# EAGLE design beagle-cape (EAGLE 6.3)

## Sheet 1 of 3
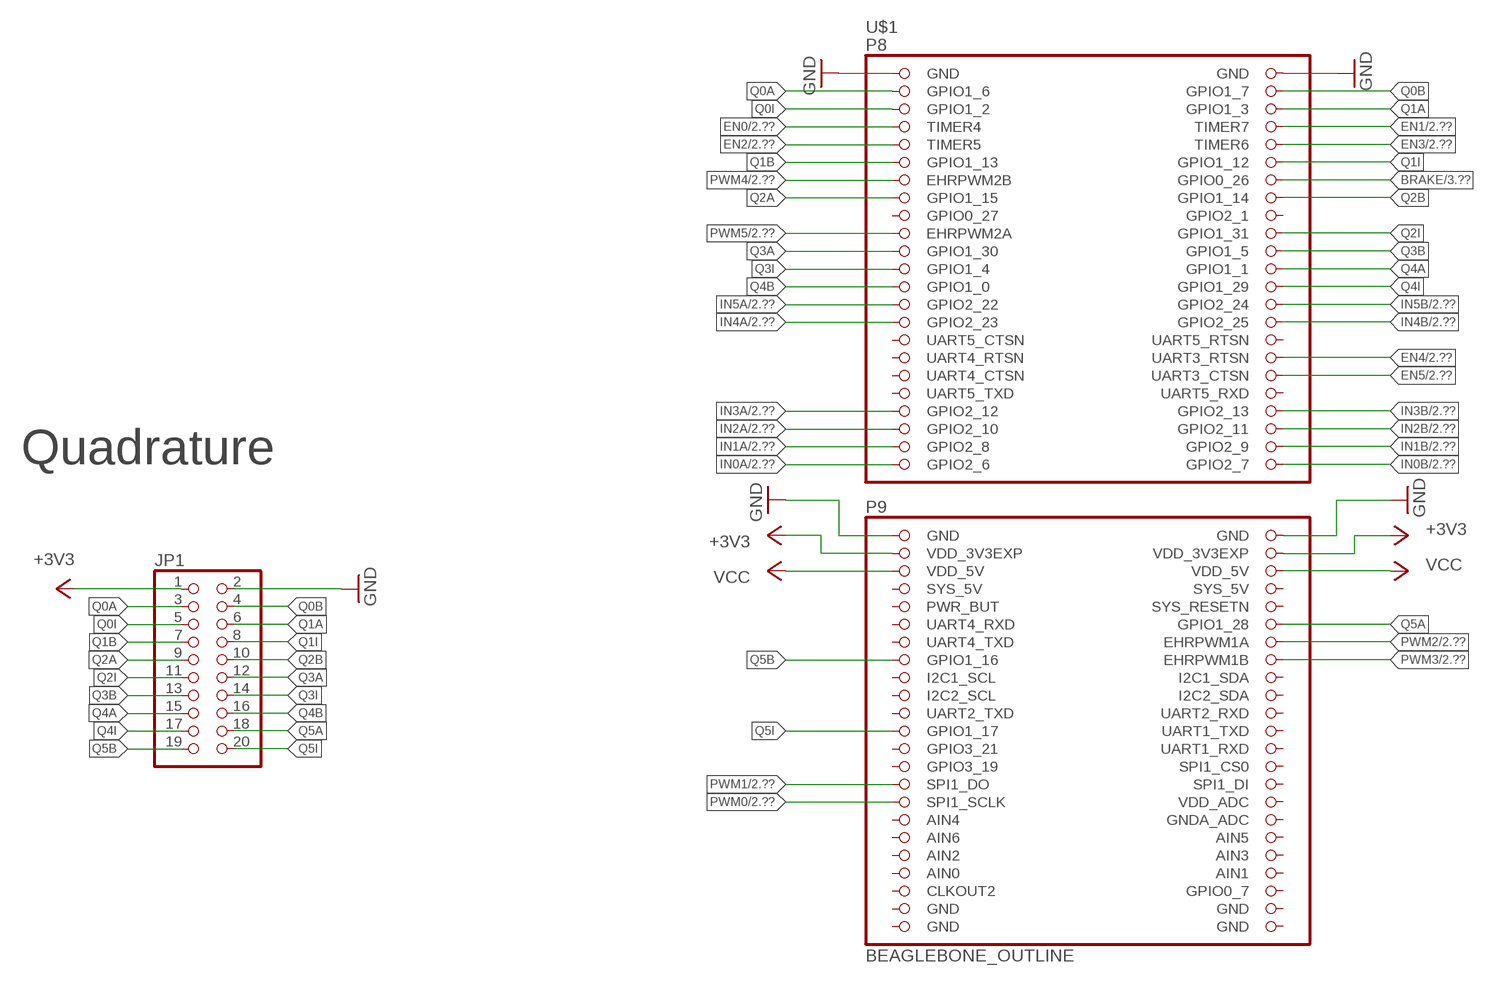
[diagram p0: schematic, sheet 1]

### Parts
JP1  PINHD-2X10  [2X10]
U$1  BEAGLEBONE_OUTLINE  [BEAGLEBONE_SHIELD]

### Nets
+3V3 [Motor]: JP1.1 U$1.49(VDD_3V3EXP) U$1.50(VDD_3V3EXP) ; also sheet 3
BRAKE: U$1.14(GPIO0_26) ; also sheet 3
EN0: U$1.7(TIMER4) ; also sheet 2
EN1: U$1.8(TIMER7) ; also sheet 2
EN2: U$1.9(TIMER5) ; also sheet 2
EN3: U$1.10(TIMER6) ; also sheet 2
EN4: U$1.34(UART3_RTSN) ; also sheet 2
EN5: U$1.36(UART3_CTSN) ; also sheet 2
GND: JP1.2 U$1.1(GND) U$1.2(GND) U$1.47(GND) U$1.48(GND) ; also sheet 2,3
IN0A: U$1.45(GPIO2_6) ; also sheet 2
IN0B: U$1.46(GPIO2_7) ; also sheet 2
IN1A: U$1.43(GPIO2_8) ; also sheet 2
IN1B: U$1.44(GPIO2_9) ; also sheet 2
IN2A: U$1.41(GPIO2_10) ; also sheet 2
IN2B: U$1.42(GPIO2_11) ; also sheet 2
IN3A: U$1.39(GPIO2_12) ; also sheet 2
IN3B: U$1.40(GPIO2_13) ; also sheet 2
IN4A: U$1.29(GPIO2_23) ; also sheet 2
IN4B: U$1.30(GPIO2_25) ; also sheet 2
IN5A: U$1.27(GPIO2_22) ; also sheet 2
IN5B: U$1.28(GPIO2_24) ; also sheet 2
PWM0: U$1.77(SPI1_SCLK) ; also sheet 2
PWM1: U$1.75(SPI1_DO) ; also sheet 2
PWM2: U$1.60(EHRPWM1A) ; also sheet 2
PWM3: U$1.62(EHRPWM1B) ; also sheet 2
PWM4: U$1.13(EHRPWM2B) ; also sheet 2
PWM5: U$1.19(EHRPWM2A) ; also sheet 2
Q0A: JP1.3 U$1.3(GPIO1_6)
Q0B: JP1.4 U$1.4(GPIO1_7)
Q0I: JP1.5 U$1.5(GPIO1_2)
Q1A: JP1.6 U$1.6(GPIO1_3)
Q1B: JP1.7 U$1.11(GPIO1_13)
Q1I: JP1.8 U$1.12(GPIO1_12)
Q2A: JP1.9 U$1.15(GPIO1_15)
Q2B: JP1.10 U$1.16(GPIO1_14)
Q2I: JP1.11 U$1.20(GPIO1_31)
Q3A: JP1.12 U$1.21(GPIO1_30)
Q3B: JP1.13 U$1.22(GPIO1_5)
Q3I: JP1.14 U$1.23(GPIO1_4)
Q4A: JP1.15 U$1.24(GPIO1_1)
Q4B: JP1.16 U$1.25(GPIO1_0)
Q4I: JP1.17 U$1.26(GPIO1_29)
Q5A: JP1.18 U$1.58(GPIO1_28)
Q5B: JP1.19 U$1.61(GPIO1_16)
Q5I: JP1.20 U$1.69(GPIO1_17)
VCC: U$1.51(VDD_5V) U$1.52(VDD_5V) ; also sheet 2,3
Unconnected: U$1.17(GPIO0_27) U$1.18(GPIO2_1) U$1.31(UART5_CTSN) U$1.32(UART5_RTSN) U$1.33(UART4_RTSN) U$1.35(UART4_CTSN) U$1.37(UART5_TXD) U$1.38(UART5_RXD) U$1.53(SYS_5V) U$1.54(SYS_5V) U$1.55(PWR_BUT) U$1.56(SYS_RESETN) U$1.57(UART4_RXD) U$1.59(UART4_TXD) U$1.63(I2C1_SCL) U$1.64(I2C1_SDA) U$1.65(I2C2_SCL) U$1.66(I2C2_SDA) U$1.67(UART2_TXD) U$1.68(UART2_RXD) U$1.70(UART1_TXD) U$1.71(GPIO3_21) U$1.72(UART1_RXD) U$1.73(GPIO3_19) U$1.74(SPI1_CS0) U$1.76(SPI1_DI) U$1.78(VDD_ADC) U$1.79(AIN4) U$1.80(GNDA_ADC) U$1.81(AIN6) U$1.82(AIN5) U$1.83(AIN2) U$1.84(AIN3) U$1.85(AIN0) U$1.86(AIN1) U$1.87(CLKOUT2) U$1.88(GPIO0_7)

### Notes on the sheet
- Quadrature

## Sheet 2 of 3
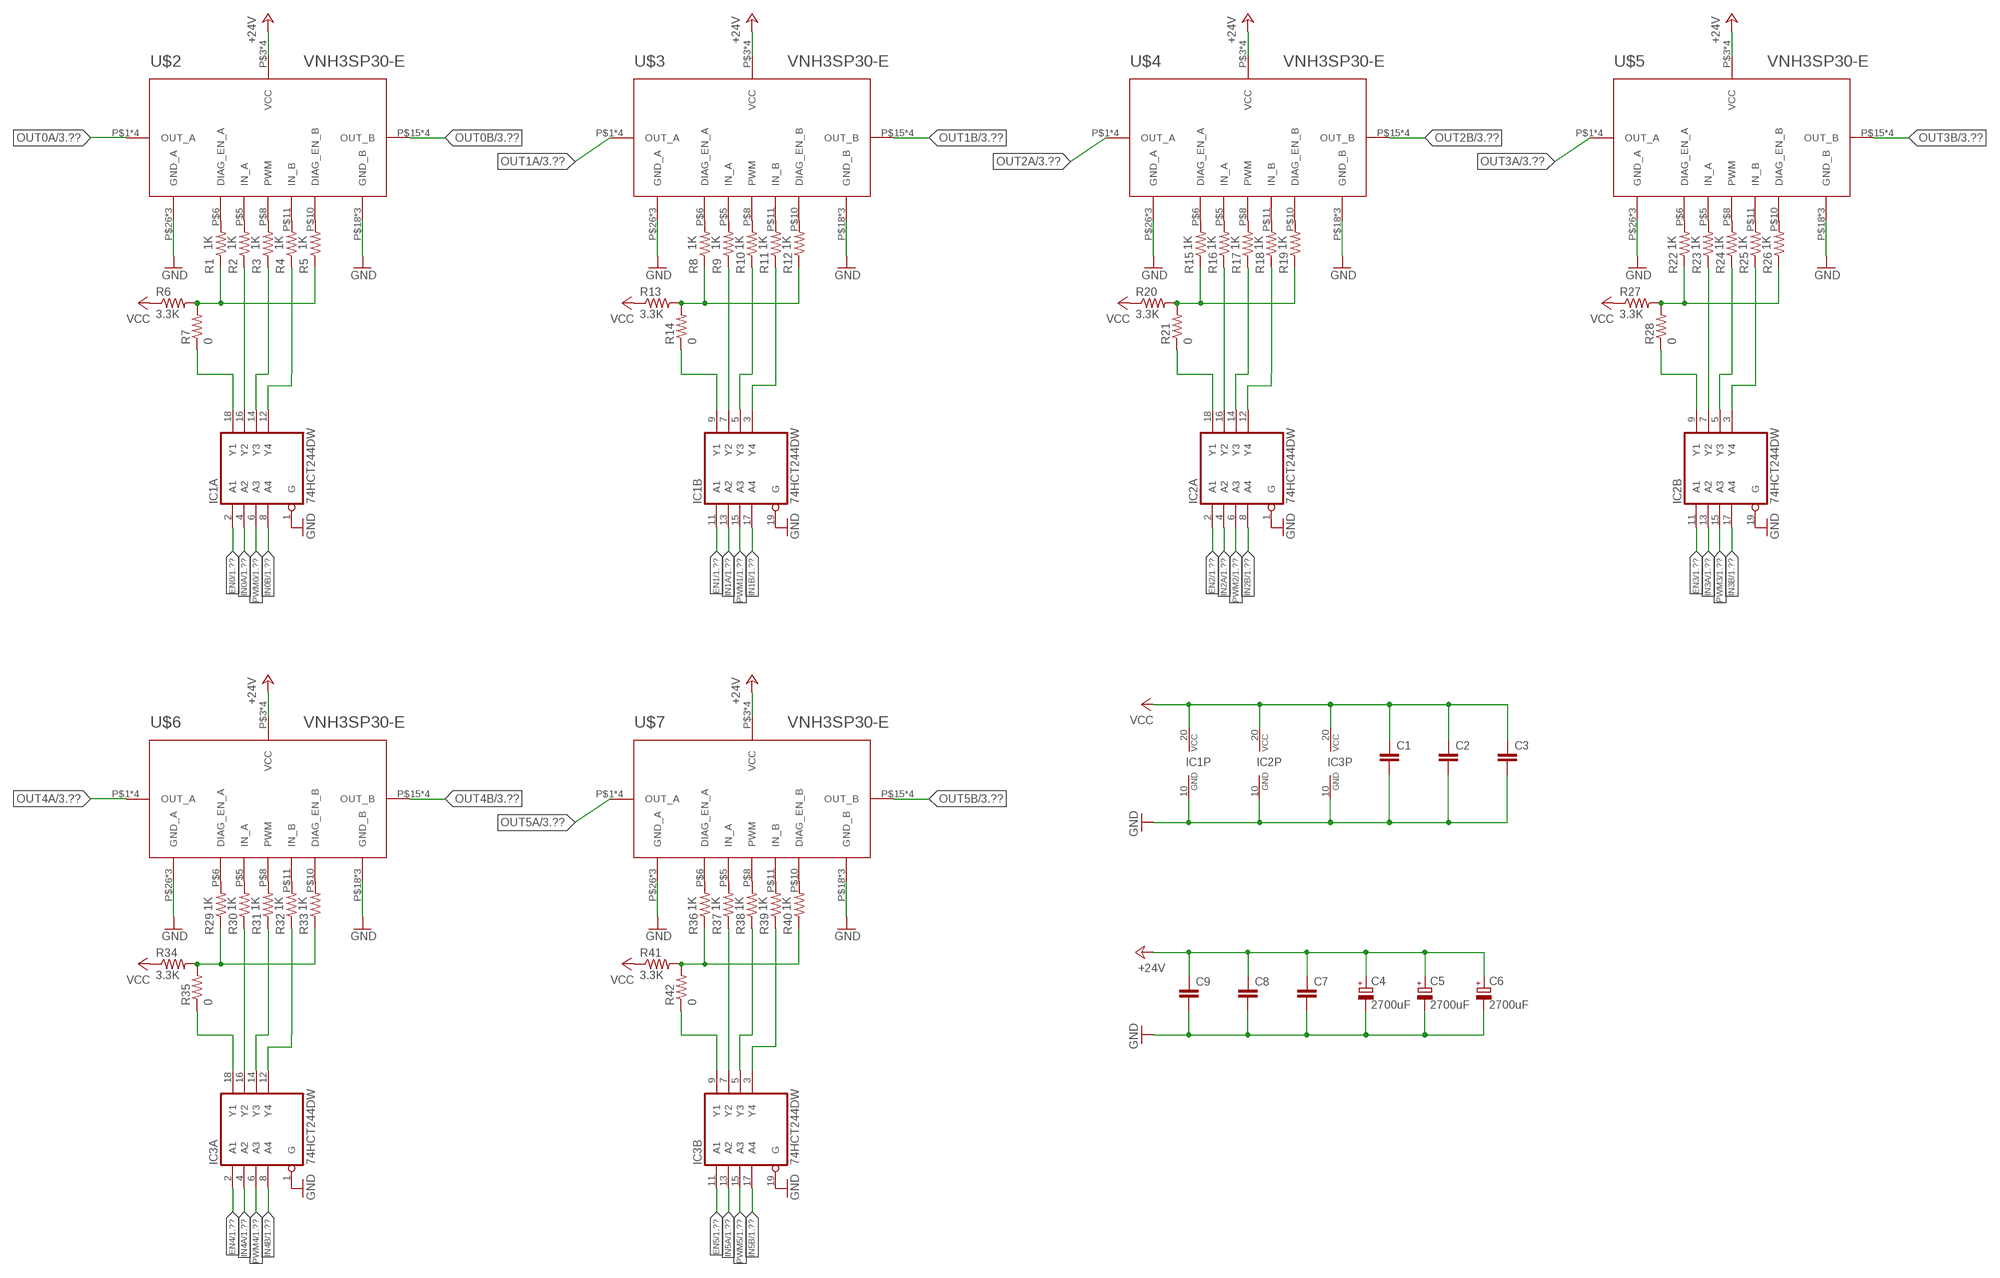
[diagram p1: schematic, sheet 2]

### Parts
C1  C-EUC1206  [C1206]
C2  C-EUC1206  [C1206]
C3  C-EUC1206  [C1206]
C4  2700uF  CPOL-EUE5-13  [E5-13]
C5  2700uF  CPOL-EUE5-13  [E5-13]
C6  2700uF  CPOL-EUE5-13  [E5-13]
C7  C-EUC1206  [C1206]
C8  C-EUC1206  [C1206]
C9  C-EUC1206  [C1206]
IC1  74HCT244DW  [SO20W]
IC2  74HCT244DW  [SO20W]
IC3  74HCT244DW  [SO20W]
R1  1K  R-US_R1206  [R1206]
R2  1K  R-US_R1206  [R1206]
R3  1K  R-US_R1206  [R1206]
R4  1K  R-US_R1206  [R1206]
R5  1K  R-US_R1206  [R1206]
R6  3.3K  R-US_R1206  [R1206]
R7  0  R-US_R1206  [R1206]
R8  1K  R-US_R1206  [R1206]
R9  1K  R-US_R1206  [R1206]
R10  1K  R-US_R1206  [R1206]
R11  1K  R-US_R1206  [R1206]
R12  1K  R-US_R1206  [R1206]
R13  3.3K  R-US_R1206  [R1206]
R14  0  R-US_R1206  [R1206]
R15  1K  R-US_R1206  [R1206]
R16  1K  R-US_R1206  [R1206]
R17  1K  R-US_R1206  [R1206]
R18  1K  R-US_R1206  [R1206]
R19  1K  R-US_R1206  [R1206]
R20  3.3K  R-US_R1206  [R1206]
R21  0  R-US_R1206  [R1206]
R22  1K  R-US_R1206  [R1206]
R23  1K  R-US_R1206  [R1206]
R24  1K  R-US_R1206  [R1206]
R25  1K  R-US_R1206  [R1206]
R26  1K  R-US_R1206  [R1206]
R27  3.3K  R-US_R1206  [R1206]
R28  0  R-US_R1206  [R1206]
R29  1K  R-US_R1206  [R1206]
R30  1K  R-US_R1206  [R1206]
R31  1K  R-US_R1206  [R1206]
R32  1K  R-US_R1206  [R1206]
R33  1K  R-US_R1206  [R1206]
R34  3.3K  R-US_R1206  [R1206]
R35  0  R-US_R1206  [R1206]
R36  1K  R-US_R1206  [R1206]
R37  1K  R-US_R1206  [R1206]
R38  1K  R-US_R1206  [R1206]
R39  1K  R-US_R1206  [R1206]
R40  1K  R-US_R1206  [R1206]
R41  3.3K  R-US_R1206  [R1206]
R42  0  R-US_R1206  [R1206]
U$2  VNH3SP30-E  [MULTIPOWER-SO-30]
U$3  VNH3SP30-E  [MULTIPOWER-SO-30]
U$4  VNH3SP30-E  [MULTIPOWER-SO-30]
U$5  VNH3SP30-E  [MULTIPOWER-SO-30]
U$6  VNH3SP30-E  [MULTIPOWER-SO-30]
U$7  VNH3SP30-E  [MULTIPOWER-SO-30]

### Nets
+24V: C4.+ C5.+ C6.+ C7.1 C8.1 C9.1 U$2.P$3(VCC) U$2.P$13(VCC) U$2.P$23(VCC) U$2.T$3(VCC) U$3.P$3(VCC) U$3.P$13(VCC) U$3.P$23(VCC) U$3.T$3(VCC) U$4.P$3(VCC) U$4.P$13(VCC) U$4.P$23(VCC) U$4.T$3(VCC) U$5.P$3(VCC) U$5.P$13(VCC) U$5.P$23(VCC) U$5.T$3(VCC) U$6.P$3(VCC) U$6.P$13(VCC) U$6.P$23(VCC) U$6.T$3(VCC) U$7.P$3(VCC) U$7.P$13(VCC) U$7.P$23(VCC) U$7.T$3(VCC) ; also sheet 3
EN0: IC1.2(A:A1) ; also sheet 1
EN1: IC1.11(B:A1) ; also sheet 1
EN2: IC2.2(A:A1) ; also sheet 1
EN3: IC2.11(B:A1) ; also sheet 1
EN4: IC3.2(A:A1) ; also sheet 1
EN5: IC3.11(B:A1) ; also sheet 1
GND: C1.2 C2.2 C3.2 C4.- C5.- C6.- C7.2 C8.2 C9.2 IC1.1(A:G) IC1.10(P:GND) IC1.19(B:G) IC2.1(A:G) IC2.10(P:GND) IC2.19(B:G) IC3.1(A:G) IC3.10(P:GND) IC3.19(B:G) U$2.P$18(GND_B) U$2.P$19(GND_B) U$2.P$20(GND_B) U$2.P$26(GND_A) U$2.P$27(GND_A) U$2.P$28(GND_A) U$3.P$18(GND_B) U$3.P$19(GND_B) U$3.P$20(GND_B) U$3.P$26(GND_A) U$3.P$27(GND_A) U$3.P$28(GND_A) U$4.P$18(GND_B) U$4.P$19(GND_B) U$4.P$20(GND_B) U$4.P$26(GND_A) U$4.P$27(GND_A) U$4.P$28(GND_A) U$5.P$18(GND_B) U$5.P$19(GND_B) U$5.P$20(GND_B) U$5.P$26(GND_A) U$5.P$27(GND_A) U$5.P$28(GND_A) U$6.P$18(GND_B) U$6.P$19(GND_B) U$6.P$20(GND_B) U$6.P$26(GND_A) U$6.P$27(GND_A) U$6.P$28(GND_A) U$7.P$18(GND_B) U$7.P$19(GND_B) U$7.P$20(GND_B) U$7.P$26(GND_A) U$7.P$27(GND_A) U$7.P$28(GND_A) ; also sheet 1,3
IN0A: IC1.4(A:A2) ; also sheet 1
IN0B: IC1.8(A:A4) ; also sheet 1
IN1A: IC1.13(B:A2) ; also sheet 1
IN1B: IC1.17(B:A4) ; also sheet 1
IN2A: IC2.4(A:A2) ; also sheet 1
IN2B: IC2.8(A:A4) ; also sheet 1
IN3A: IC2.13(B:A2) ; also sheet 1
IN3B: IC2.17(B:A4) ; also sheet 1
IN4A: IC3.4(A:A2) ; also sheet 1
IN4B: IC3.8(A:A4) ; also sheet 1
IN5A: IC3.13(B:A2) ; also sheet 1
IN5B: IC3.17(B:A4) ; also sheet 1
N$1: R1.2 U$2.P$6(DIAG_EN_A)
N$2: R1.1 R5.1 R6.2 R7.2
N$3: IC1.18(A:Y1) R7.1
N$4: IC1.16(A:Y2) R2.1
N$5: IC1.14(A:Y3) R3.1
N$6: IC1.12(A:Y4) R4.1
N$9: R2.2 U$2.P$5(IN_A)
N$10: R3.2 U$2.P$8(PWM)
N$11: R4.2 U$2.P$11(IN_B)
N$12: R5.2 U$2.P$10(DIAG_EN_B)
N$13: R8.2 U$3.P$6(DIAG_EN_A)
N$14: R8.1 R12.1 R13.2 R14.2
N$15: IC1.9(B:Y1) R14.1
N$16: IC1.7(B:Y2) R9.1
N$17: IC1.5(B:Y3) R10.1
N$18: IC1.3(B:Y4) R11.1
N$20: R39.2 U$7.P$11(IN_B)
N$21: R38.2 U$7.P$8(PWM)
N$22: R37.2 U$7.P$5(IN_A)
N$23: R40.2 U$7.P$10(DIAG_EN_B)
N$24: R15.2 U$4.P$6(DIAG_EN_A)
N$25: R15.1 R19.1 R20.2 R21.2
N$26: IC2.18(A:Y1) R21.1
N$27: IC2.16(A:Y2) R16.1
N$28: IC2.14(A:Y3) R17.1
N$29: IC2.12(A:Y4) R18.1
N$30: R12.2 U$3.P$10(DIAG_EN_B)
N$31: R11.2 U$3.P$11(IN_B)
N$32: R16.2 U$4.P$5(IN_A)
N$33: R17.2 U$4.P$8(PWM)
N$34: R18.2 U$4.P$11(IN_B)
N$35: R19.2 U$4.P$10(DIAG_EN_B)
N$36: R22.2 U$5.P$6(DIAG_EN_A)
N$37: R22.1 R26.1 R27.2 R28.2
N$38: IC2.9(B:Y1) R28.1
N$39: IC2.7(B:Y2) R23.1
N$40: IC2.5(B:Y3) R24.1
N$41: IC2.3(B:Y4) R25.1
N$42: R10.2 U$3.P$8(PWM)
N$43: R9.2 U$3.P$5(IN_A)
N$44: R29.2 U$6.P$6(DIAG_EN_A)
N$45: R29.1 R33.1 R34.2 R35.2
N$46: IC3.18(A:Y1) R35.1
N$47: IC3.16(A:Y2) R30.1
N$48: IC3.14(A:Y3) R31.1
N$49: IC3.12(A:Y4) R32.1
N$50: R26.2 U$5.P$10(DIAG_EN_B)
N$51: R25.2 U$5.P$11(IN_B)
N$52: R30.2 U$6.P$5(IN_A)
N$53: R31.2 U$6.P$8(PWM)
N$54: R32.2 U$6.P$11(IN_B)
N$55: R33.2 U$6.P$10(DIAG_EN_B)
N$56: R36.2 U$7.P$6(DIAG_EN_A)
N$57: R36.1 R40.1 R41.2 R42.2
N$58: IC3.9(B:Y1) R42.1
N$59: IC3.7(B:Y2) R37.1
N$60: IC3.5(B:Y3) R38.1
N$61: IC3.3(B:Y4) R39.1
N$62: R24.2 U$5.P$8(PWM)
N$63: R23.2 U$5.P$5(IN_A)
OUT0A [Motor]: U$2.P$1(OUT_A) U$2.P$25(OUT_A) U$2.P$30(OUT_A) U$2.T$1(OUT_A) ; also sheet 3
OUT0B [Motor]: U$2.P$15(OUT_B) U$2.P$16(OUT_B) U$2.P$21(OUT_B) U$2.T$2(OUT_B) ; also sheet 3
OUT1A [Motor]: U$3.P$1(OUT_A) U$3.P$25(OUT_A) U$3.P$30(OUT_A) U$3.T$1(OUT_A) ; also sheet 3
OUT1B [Motor]: U$3.P$15(OUT_B) U$3.P$16(OUT_B) U$3.P$21(OUT_B) U$3.T$2(OUT_B) ; also sheet 3
OUT2A [Motor]: U$4.P$1(OUT_A) U$4.P$25(OUT_A) U$4.P$30(OUT_A) U$4.T$1(OUT_A) ; also sheet 3
OUT2B [Motor]: U$4.P$15(OUT_B) U$4.P$16(OUT_B) U$4.P$21(OUT_B) U$4.T$2(OUT_B) ; also sheet 3
OUT3A [Motor]: U$5.P$1(OUT_A) U$5.P$25(OUT_A) U$5.P$30(OUT_A) U$5.T$1(OUT_A) ; also sheet 3
OUT3B [Motor]: U$5.P$15(OUT_B) U$5.P$16(OUT_B) U$5.P$21(OUT_B) U$5.T$2(OUT_B) ; also sheet 3
OUT4A [Motor]: U$6.P$1(OUT_A) U$6.P$25(OUT_A) U$6.P$30(OUT_A) U$6.T$1(OUT_A) ; also sheet 3
OUT4B [Motor]: U$6.P$15(OUT_B) U$6.P$16(OUT_B) U$6.P$21(OUT_B) U$6.T$2(OUT_B) ; also sheet 3
OUT5A [Motor]: U$7.P$1(OUT_A) U$7.P$25(OUT_A) U$7.P$30(OUT_A) U$7.T$1(OUT_A) ; also sheet 3
OUT5B [Motor]: U$7.P$15(OUT_B) U$7.P$16(OUT_B) U$7.P$21(OUT_B) U$7.T$2(OUT_B) ; also sheet 3
PWM0: IC1.6(A:A3) ; also sheet 1
PWM1: IC1.15(B:A3) ; also sheet 1
PWM2: IC2.6(A:A3) ; also sheet 1
PWM3: IC2.15(B:A3) ; also sheet 1
PWM4: IC3.6(A:A3) ; also sheet 1
PWM5: IC3.15(B:A3) ; also sheet 1
VCC: C1.1 C2.1 C3.1 IC1.20(P:VCC) IC2.20(P:VCC) IC3.20(P:VCC) R6.1 R13.1 R20.1 R27.1 R34.1 R41.1 ; also sheet 1,3

## Sheet 3 of 3
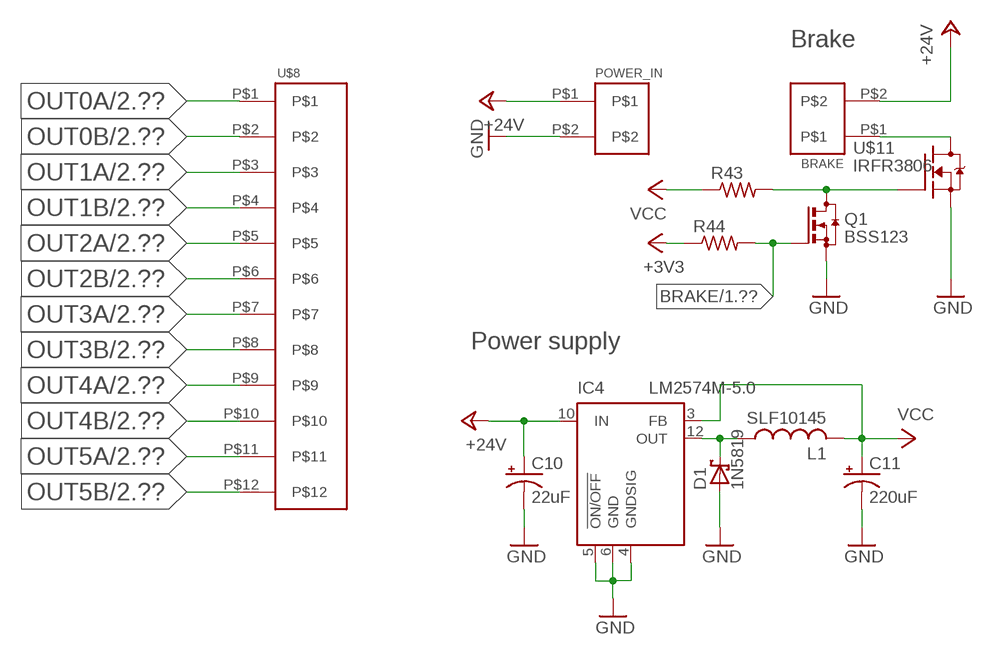
[diagram p2: schematic, sheet 3]

### Parts
BRAKE  PINHEAD-5MM-1X2  [5MM-HEADER-2]
C10  22uF  CPOL-USSANYO_SMD_E7  [SANYO-OSCON_SMD_E7]
C11  220uF  CPOL-USSANYO_SMD_F8  [SANYO-OSCON_SMD_F8]
D1  1N5819  [SOD-123]
IC4  LM2574M-5.0  [SO14W]
L1  SLF10145  [SMD10145]
POWER_IN  PINHEAD-5MM-1X2  [5MM-HEADER-2]
Q1  BSS123  [SOT23]
R43  R-US_R1206  [R1206]
R44  R-US_R1206  [R1206]
U$8  PINHEAD-0.2IN-1X12  [0.2IN-TERMINAL-BLOCK-12]
U$11  IRFR3806  [TO252]

### Nets
+3V3 [Motor]: R44.1 ; also sheet 1
+24V: BRAKE.P$2 C10.+ IC4.10(IN) POWER_IN.P$1 ; also sheet 2
BRAKE: Q1.1(G) R44.2 ; also sheet 1
GND: C10.- C11.- D1.A IC4.4(GNDSIG) IC4.5(!ON/OFF) IC4.6(GND) POWER_IN.P$2 Q1.2(S) U$11.2(S) ; also sheet 1,2
N$7: D1.C IC4.12(OUT) L1.P$1
N$8 [Motor]: BRAKE.P$1 U$11.3(D)
N$19: Q1.3(D) R43.2 U$11.1(G)
OUT0A [Motor]: U$8.P$1 ; also sheet 2
OUT0B [Motor]: U$8.P$2 ; also sheet 2
OUT1A [Motor]: U$8.P$3 ; also sheet 2
OUT1B [Motor]: U$8.P$4 ; also sheet 2
OUT2A [Motor]: U$8.P$5 ; also sheet 2
OUT2B [Motor]: U$8.P$6 ; also sheet 2
OUT3A [Motor]: U$8.P$7 ; also sheet 2
OUT3B [Motor]: U$8.P$8 ; also sheet 2
OUT4A [Motor]: U$8.P$9 ; also sheet 2
OUT4B [Motor]: U$8.P$10 ; also sheet 2
OUT5A [Motor]: U$8.P$11 ; also sheet 2
OUT5B [Motor]: U$8.P$12 ; also sheet 2
VCC: C11.+ IC4.3(FB) L1.P$2 R43.1 ; also sheet 1,2

### Notes on the sheet
- Brake
- Power supply

## Power pins joined to a net without a drawn wire
GND: U$1.89(GND) U$1.90(GND) U$1.91(GND) U$1.92(GND)

## Library data of the parts
BRAKE POWER_IN = controller:PINHEAD-5MM-1X2
C1-C3 C7-C9 = rcl:C-EU: CAPACITOR, European symbol
C4-C6 = rcl:CPOL-EU: POLARIZED CAPACITOR, European symbol
C10 C11 = rcl:CPOL-US: POLARIZED CAPACITOR, American symbol
D1 = typewriter-project:1N5819
IC1-IC3 = 74xx-eu:74*244: Octal BUFFER and LINE DRIVER, 3-state
IC4 = linear:LM2574?-*: SIMPLE SWITCHER 0.5A Step-Down Voltage Regulator Source: http://cache.national.com/ds/LM/LM2574.pdf
JP1 = pinhead:PINHD-2X10: PIN HEADER
L1 = typewriter-project:SLF10145
Q1 = transistor-small-signal:BSS123: N-CHANNEL MOS FET
R1-R42 = resistor:R-US_: RESISTOR, American symbol
R43 R44 = rcl:R-US_: RESISTOR, American symbol
U$1 = controller:BEAGLEBONE_OUTLINE: Should match A3 pinout - but not completely tested
U$2-U$7 = controller:VNH3SP30
U$8 = controller:PINHEAD-0.2IN-1X12
U$11 = controller:IRF?3806

## Net classes
1 Motor: width 0.5 mm, clearance 0.3 mm

## Board
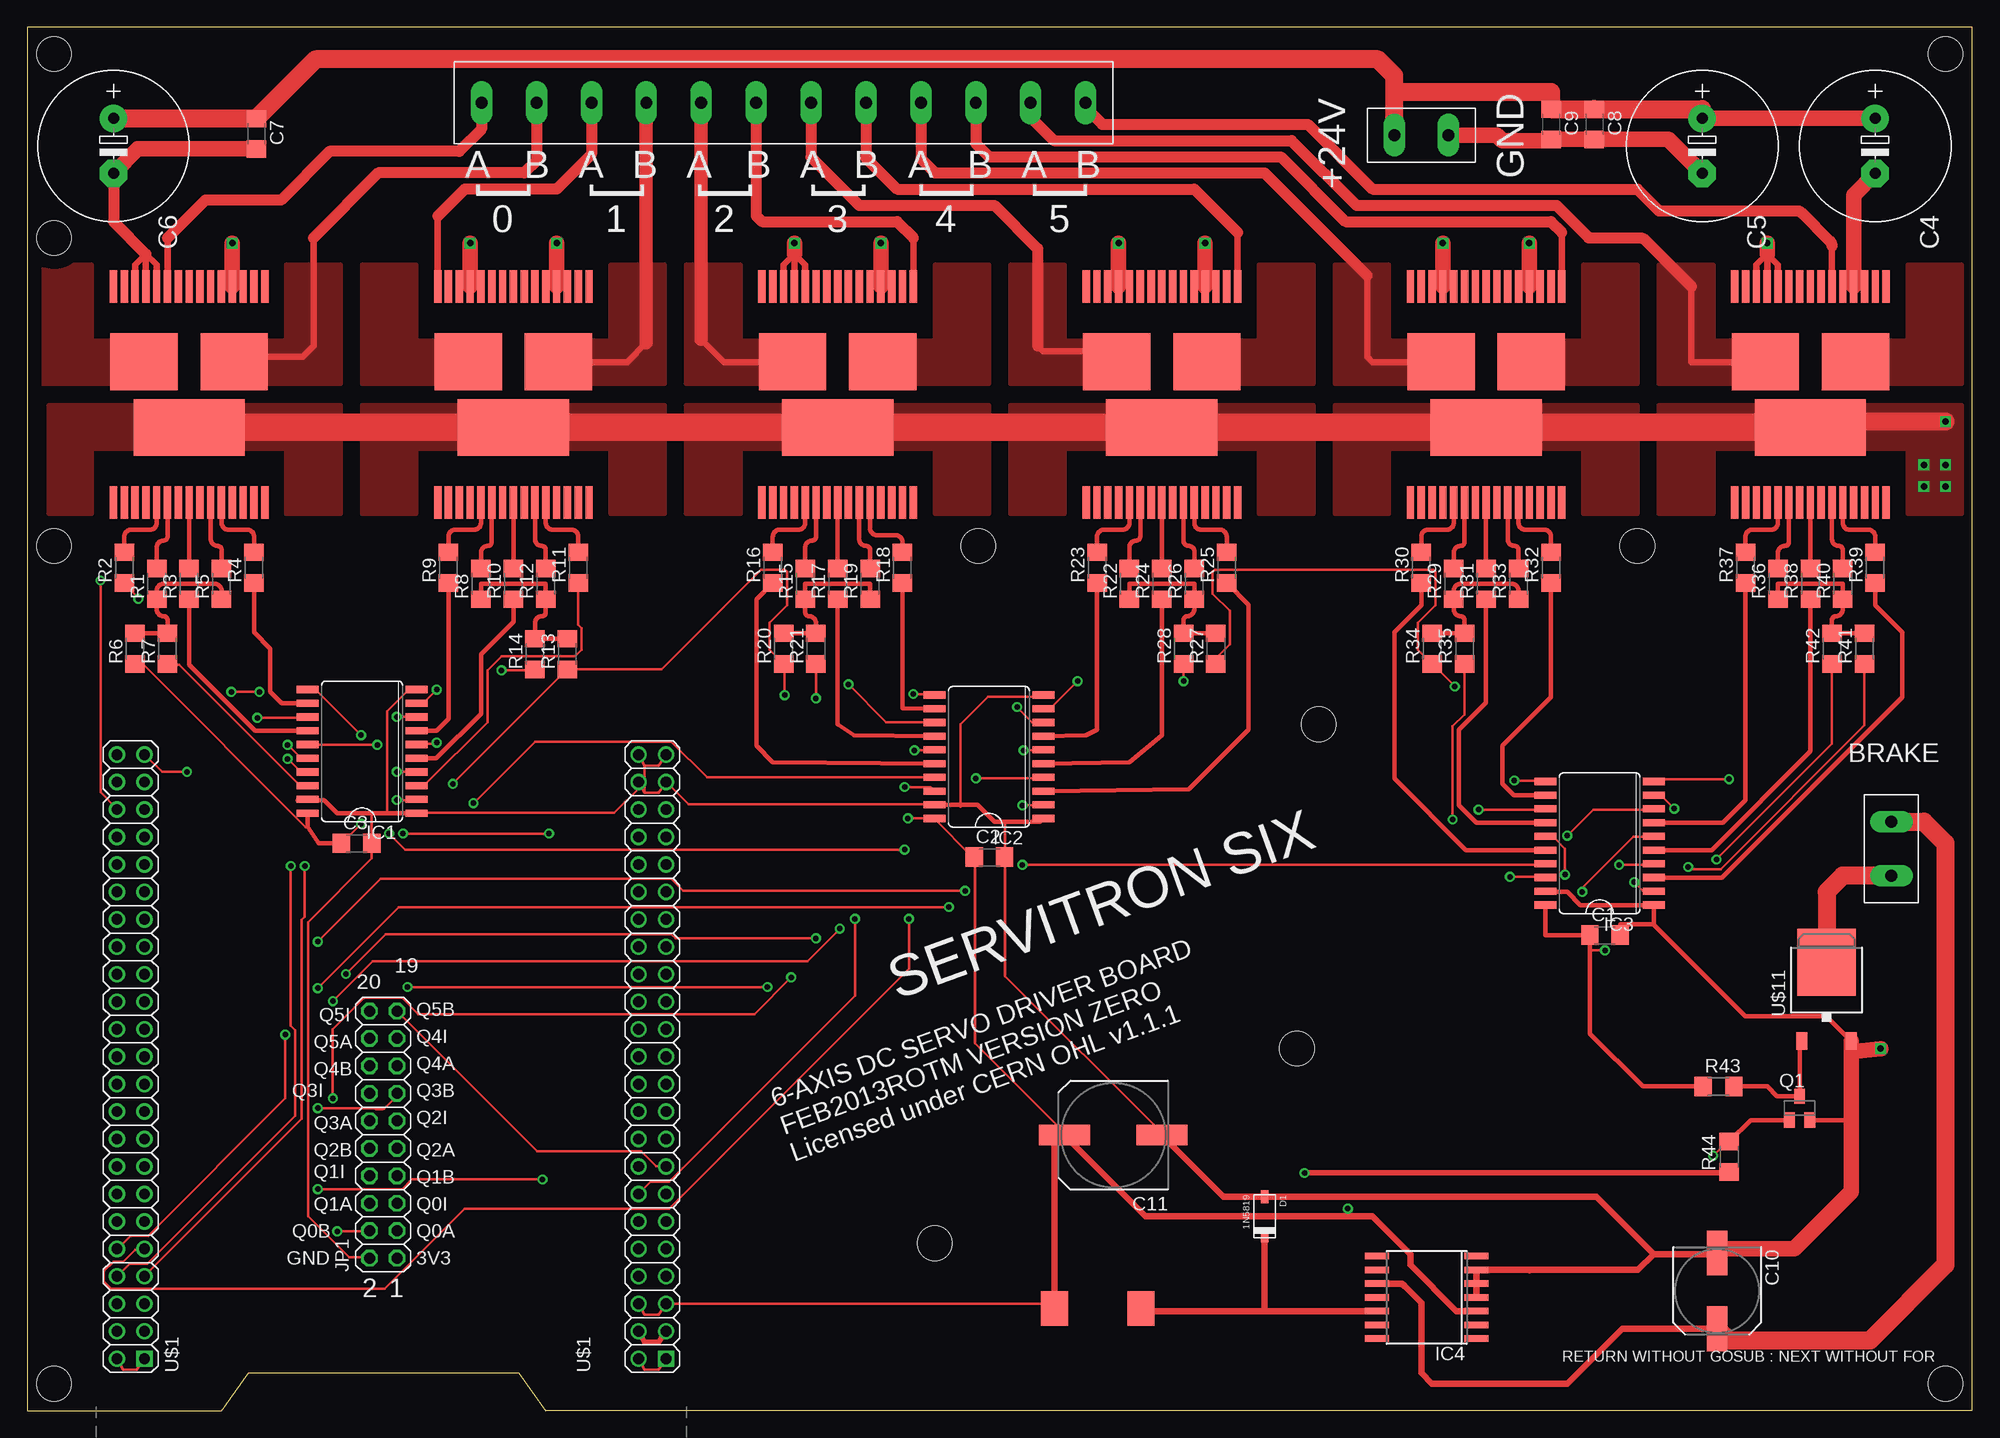
[diagram p3: board, top side]
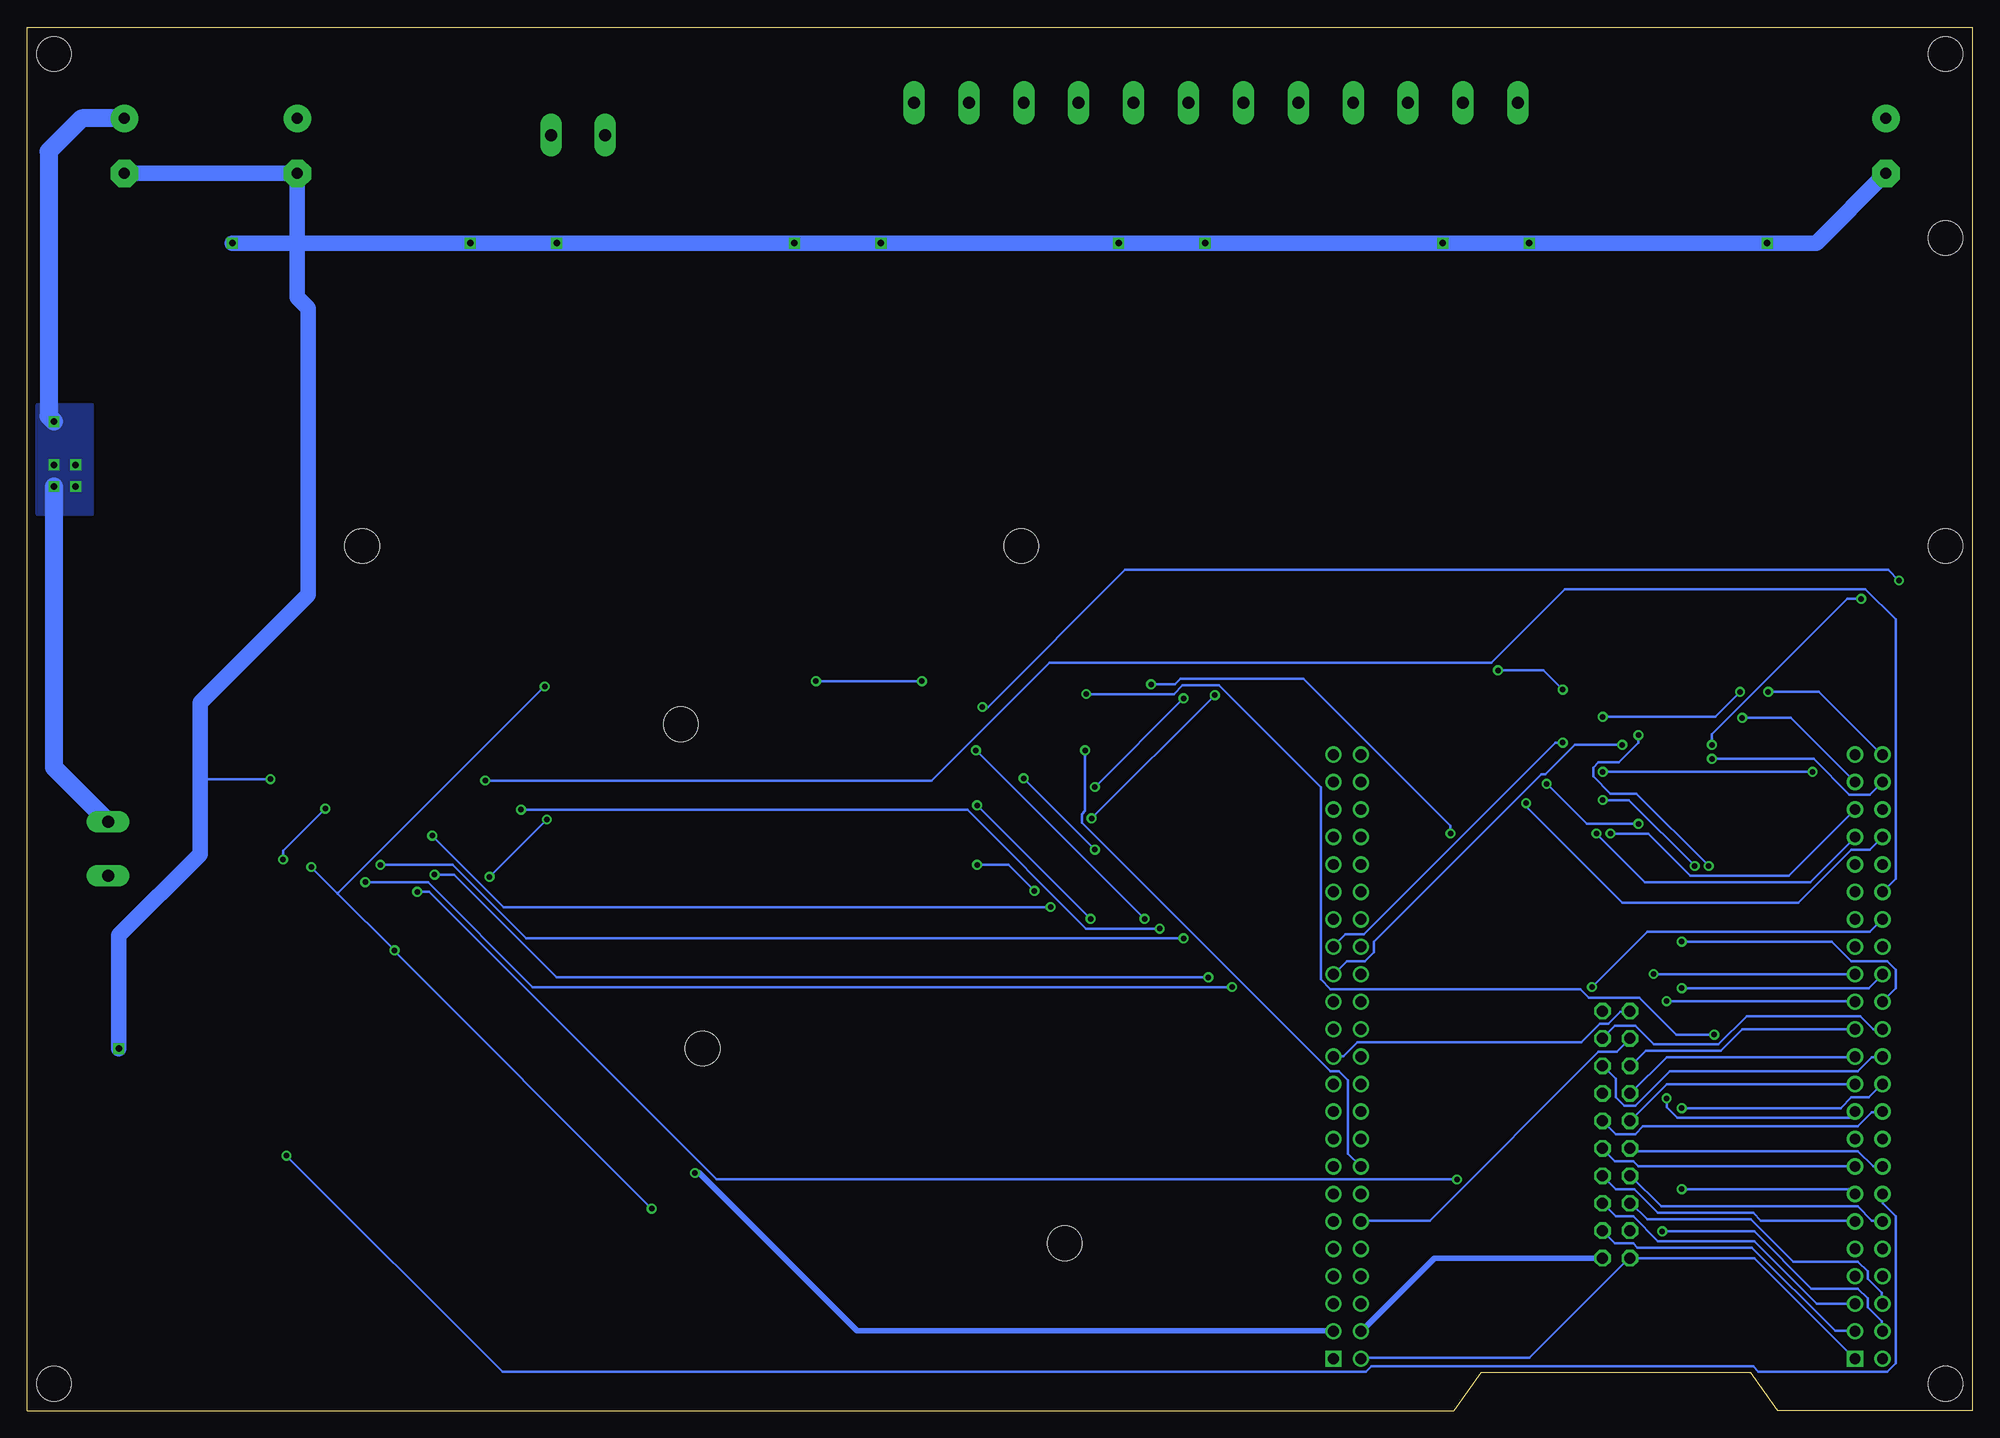
[diagram p4: board, bottom side, seen from below]

Size 180 x 128 mm. Coordinates in mm from the lower left corner, seen from the top.
Outline: 180,0 180,128 0,128 0,0 18,0 20.5,3.5 45.5,3.5 48,0 180,0
Copper layers (1*16): Top 0.035559375mm / dielectric 1.501140625mm / Bottom 0.035559375mm
Design rules "typical_4pcb": minimum track width 10mil, minimum drill 15mil, track to track 6mil, track to pad 6mil, pad to pad 6mil, via to via 6mil, smd to smd 6mil, copper to edge 15mil, drill to drill 8mil, minimum pad ring 10mil, minimum via ring 8mil, stop-mask expansion 4mil, vias tented up to drill 0mil, thermal gap 10mil
Holes 3.2 mm at 2.5,125.5 177.5,125.5 177.5,2.5 2.5,2.5 2.5,108.5 2.5,80 149,80 88,80 84,15.5 117.5,33.5 119.5,63.5

### Footprints (pad centres in the part's own frame; a part is rotated, then mirrored left to right if it is on the bottom)
5MM-HEADER-2 = drill 1.1 pad 2 long: P$1 -2.5,0; P$2 2.5,0
C1206 = smd 1.6 x 1.8: 1 -1.4,0; 2 1.4,0
E5-13 = drill 1.016 pad 2.54: + -2.54,0 | drill 1.016 pad 2.54 octagon: - 2.54,0
SANYO-OSCON_SMD_E7 = smd 4.15 x 1.9: + 3.5,0; - -3.5,0
SANYO-OSCON_SMD_F8 = smd 4.7 x 1.9: + 4.5,0; - -4.5,0
SOD-123 = smd 1.2 x 0.7: A -1.8,0; C 1.8,0
SO20W = smd 0.66 x 2.032: 1 -5.715,-5.029; 2 -4.445,-5.029; 3 -3.175,-5.029; 4 -1.905,-5.029; 5 -0.635,-5.029; 6 0.635,-5.029; 7 1.905,-5.029; 8 3.175,-5.029; 9 4.445,-5.029; 10 5.715,-5.029; 11 5.715,5.029; 12 4.445,5.029; 13 3.175,5.029; 14 1.905,5.029; 15 0.635,5.029; 16 -0.635,5.029; 17 -1.905,5.029; 18 -3.175,5.029; 19 -4.445,5.029; 20 -5.715,5.029
SO14W = smd 0.6 x 2.2: 1 -3.81,-4.6; 2 -2.54,-4.6; 3 -1.27,-4.6; 4 0,-4.6; 5 1.27,-4.6; 6 2.54,-4.6; 7 3.81,-4.6; 8 3.81,4.6; 9 2.54,4.6; 10 1.27,4.6; 11 0,4.6; 12 -1.27,4.6; 13 -2.54,4.6; 14 -3.81,4.6
2X10 = drill 1.016 octagon: 1 -11.43,-1.27; 2 -11.43,1.27; 3 -8.89,-1.27; 4 -8.89,1.27; 5 -6.35,-1.27; 6 -6.35,1.27; 7 -3.81,-1.27; 8 -3.81,1.27; 9 -1.27,-1.27; 10 -1.27,1.27; 11 1.27,-1.27; 12 1.27,1.27; 13 3.81,-1.27; 14 3.81,1.27; 15 6.35,-1.27; 16 6.35,1.27; 17 8.89,-1.27; 18 8.89,1.27; 19 11.43,-1.27; 20 11.43,1.27
SMD10145 = smd 3.2 x 2.5: P$1 0,4; P$2 0,-4
SOT23 = smd 1 x 1.4: 1 -0.95,-1.1; 2 0.95,-1.1; 3 0,1.1
R1206 = smd 1.6 x 1.803: 1 -1.422,0; 2 1.422,0
BEAGLEBONE_SHIELD = drill 1 square: 1 4.445,19.05; 47 52.705,19.05 | drill 1: 2 1.905,19.05; 3 4.445,21.59; 4 1.905,21.59; 5 4.445,24.13; 6 1.905,24.13; 7 4.445,26.67; 8 1.905,26.67; 9 4.445,29.21; 10 1.905,29.21; 11 4.445,31.75; 12 1.905,31.75; 13 4.445,34.29; 14 1.905,34.29; 15 4.445,36.83; 16 1.905,36.83; 17 4.445,39.37; 18 1.905,39.37; 19 4.445,41.91; 20 1.905,41.91; 21 4.445,44.45; 22 1.905,44.45; 23 4.445,46.99; 24 1.905,46.99; 25 4.445,49.53; 26 1.905,49.53; 27 4.445,52.07; 28 1.905,52.07; 29 4.445,54.61; 30 1.905,54.61; 31 4.445,57.15; 32 1.905,57.15; 33 4.445,59.69; 34 1.905,59.69; 35 4.445,62.23; 36 1.905,62.23; 37 4.445,64.77; 38 1.905,64.77; 39 4.445,67.31; 40 1.905,67.31; 41 4.445,69.85; 42 1.905,69.85; 43 4.445,72.39; 44 1.905,72.39; 45 4.445,74.93; 46 1.905,74.93; 48 50.165,19.05; 49 52.705,21.59; 50 50.165,21.59; 51 52.705,24.13; 52 50.165,24.13; 53 52.705,26.67; 54 50.165,26.67; 55 52.705,29.21; 56 50.165,29.21; 57 52.705,31.75; 58 50.165,31.75; 59 52.705,34.29; 60 50.165,34.29; 61 52.705,36.83; 62 50.165,36.83; 63 52.705,39.37; 64 50.165,39.37; 65 52.705,41.91; 66 50.165,41.91; 67 52.705,44.45; 68 50.165,44.45; 69 52.705,46.99; 70 50.165,46.99; 71 52.705,49.53; 72 50.165,49.53; 73 52.705,52.07; 74 50.165,52.07; 75 52.705,54.61; 76 50.165,54.61; 77 52.705,57.15; 78 50.165,57.15; 79 52.705,59.69; 80 50.165,59.69; 81 52.705,62.23; 82 50.165,62.23; 83 52.705,64.77; 84 50.165,64.77; 85 52.705,67.31; 86 50.165,67.31; 87 52.705,69.85; 88 50.165,69.85; 89 52.705,72.39; 90 50.165,72.39; 91 52.705,74.93; 92 50.165,74.93
MULTIPOWER-SO-30 = smd 0.68 x 3: P$1 -7,-10; P$2 -6,-10; P$3 -5,-10; P$4 -4,-10; P$5 -3,-10; P$6 -2,-10; P$7 -1,-10; P$8 0,-10; P$9 1,-10; P$10 2,-10; P$11 3,-10; P$12 4,-10; P$13 5,-10; P$14 6,-10; P$15 7,-10; P$16 7,10; P$17 6,10; P$18 5,10; P$19 4,10; P$20 3,10; P$21 2,10; P$22 1,10; P$23 0,10; P$24 -1,10; P$25 -2,10; P$26 -3,10; P$27 -4,10; P$28 -5,10; P$29 -6,10; P$30 -7,10 | smd 6.23 x 5.25: T$1 -4.165,3.05; T$2 4.165,3.05 | smd 10.3 x 5.25: T$3 0,-3.05
0.2IN-TERMINAL-BLOCK-12 = drill 1.1 pad 2 long: P$1 -27.94,0; P$2 -22.86,0; P$3 -17.78,0; P$4 -12.7,0; P$5 -7.62,0; P$6 -2.54,0; P$7 2.54,0; P$8 7.62,0; P$9 12.7,0; P$10 17.78,0; P$11 22.86,0; P$12 27.94,0
TO252 = smd 1 x 1.6: 1 -2.28,-4.8; 2 2.28,-4.8 | smd 5.4 x 6.2: 3 0,2.5

### Placement (x,y rotation side)
BRAKE  172.5,52 90 top
C1  146,44 0 top
C2  89.04,51.21 0 top
C3  30.5,52.5 0 top
C4  171,117 270 top
C5  155,117 270 top
C6  8,117 270 top
C7  21.21,118.12 270 top
C8  145,119 270 top
C9  141,119 270 top
C10  156.38,11.1 270 top
C11  100.5,25.5 180 top
D1  114.5,18 270 top
IC1  31,61 90 top
IC2  89,60.5 90 top
IC3  145.5,52.5 90 top
IC4  129.5,10.5 90 top
JP1  32.96,25.55 90 top
L1  99.08,9.48 270 top
POWER_IN  129,118 0 top
Q1  164,28 0 top
R1  12,76.5 90 top
R2  9,78 90 top
R3  15,76.5 90 top
R4  21,78 90 top
R5  18,76.5 90 top
R6  10,70.5 90 top
R7  13,70.5 90 top
R8  42,76.5 90 top
R9  39,78 90 top
R10  45,76.5 90 top
R11  51,78 90 top
R12  48,76.5 90 top
R13  50,70 90 top
R14  47,70 90 top
R15  72,76.5 90 top
R16  69,78 90 top
R17  75,76.5 90 top
R18  81,78 90 top
R19  78,76.5 90 top
R20  70,70.5 90 top
R21  73,70.5 90 top
R22  102,76.5 90 top
R23  99,78 90 top
R24  105,76.5 90 top
R25  111,78 90 top
R26  108,76.5 90 top
R27  110,70.5 90 top
R28  107,70.5 90 top
R29  132,76.5 90 top
R30  129,78 90 top
R31  135,76.5 90 top
R32  141,78 90 top
R33  138,76.5 90 top
R34  130,70.5 90 top
R35  133,70.5 90 top
R36  162,76.5 90 top
R37  159,78 90 top
R38  165,76.5 90 top
R39  171,78 90 top
R40  168,76.5 90 top
R41  170,70.5 90 top
R42  167,70.5 90 top
R43  156.5,30 0 top
R44  157.5,23.5 90 top
U$1  6.42,-14.23 0 top
U$2  15,94 0 top
U$3  45,94 0 top
U$4  75,94 0 top
U$5  105,94 0 top
U$6  135,94 0 top
U$7  165,94 0 top
U$8  70,121 0 top
U$11  166.5,39 0 top

### Tracks (layer width: path | path; a pad name or v marks a point on that pad's centre or on a via)
+3V3  (via drill 0.51)
  Top 0.5: U$1.50 57.15,6.35 58.42,6.35 U$1.49 | v118.2,22 157.5,22 R44.1
  Bottom 0.5: v118.2,22 117.8,22 103.2,7.4 59.2,7.4 U$1.49 | JP1.1 34.3,14.1 49.8,14.1 56.5,7.4 U$1.50
+24V  (via drill 0.6)
  Top 0.61: C10.+ 147.6,7.6 142.5,2.5 130,2.5 129,3.5 129,10 127.5,11.5 127.23,11.77 IC4.10
  Top 1.422: C5.+ C4.+
  Top 1.676: C5.+ 155,120.4 C8.1 C9.1 141,122 126.5,122 POWER_IN.P$1 126.5,123.5 125,125 26.69,125 C7.1 8.02,119.52 C6.+ | v177.5,91.5 165.55,91.5 U$7.T$3 | BRAKE.P$2 175.5,54.5 177.5,52.5 177.5,13.5 170.5,6.5 157.48,6.5 C10.+
  Top 2.54: 15,91 45,91 | 45,91 U$3.T$3 | 45,91 75,91 | 75,91 U$4.T$3 | 75,91 105,91 | 105,91 U$5.T$3 | 105,91 135,91 | 135,91 U$6.T$3 | 135,91 165,91 U$7.T$3
  Bottom 1.676: C4.+ 174.96,119.54 178,116.5 178,92 v177.5,91.5 | BRAKE.P$2 177.5,59.5 v177.5,85.5
  other vias: 175.5,87.5 177.5,87.5 175.5,85.5
  pour Top (no thermals): 151,83 156,83 156,89 174,89 174,83 179,83 179,93 151,93
  pour Top (no thermals): 121,83 126,83 126,89 144,89 144,83 149,83 149,93 121,93
  pour Top (no thermals): 91,83 96,83 96,89 114,89 114,83 119,83 119,93 91,93
  pour Top (no thermals): 61,83 66,83 66,89 84,89 84,83 89,83 89,93 61,93
  pour Top (no thermals): 31,83 36,83 36,89 54,89 54,83 59,83 59,93 31,93
  pour Top (no thermals): 6,83 6,89 24,89 24,83 29,83 29,93 2,93 2,83
  pour Bottom: 179,93 174,93 174,83 179,83
BRAKE  (via drill 0.51)
  Top 0.254: v156,23.6 157.3,24.9 R44.2
  Top 0.406: Q1.1 159.48,26.9 R44.2
  Bottom 0.254: v156,23.6 136,3.6 56.1,3.6 55.6,4.1 20.3,4.1 19.8,3.6 7.9,3.6 7.1,4.4 7.1,18 8.3,19.2 8.3,20 U$1.14
EN0  (via drill 0.51)
  Top 0.254: v34.2,56.5 36,56.5 IC1.2 | v25.7,50.4 25.7,45.7 25.4,45.4 25.4,27 10.9,12.5 U$1.7
  Bottom 0.254: v34.2,56.5 31.8,56.5 v25.7,50.4
EN1  (via drill 0.51)
  Top 0.254: v30.9,62.5 26.7,66.7 26,66.7 IC1.11 | v24.4,50.4 24.4,35.6 24.8,35.2 24.8,27.3 11.1,13.6 9.5,13.6 8.4,12.5 U$1.8
  Bottom 0.254: v30.9,62.5 30.9,61.8 32.7,60 34.6,60 35.1,59.5 35.1,58.7 33.5,57.1 31.1,57.1 v24.4,50.4
EN2  (via drill 0.51)
  Top 0.254: v92.1,56 94,56 IC2.2 | v81.6,45.5 81.6,40.9 59.4,18.7 40.5,18.7 33.1,11.3 7.8,11.3 7.1,12 7.1,12.9 8,13.8 8.9,13.8 10,14.9 10.8,14.9 U$1.9
  Bottom 0.254: v81.6,45.5 v92.1,56
EN3  (via drill 0.51)
  Top 0.254: v82,66.3 83.9,66.3 IC2.11 | v23.9,34.8 23.9,28.9 11.2,16.2 9.6,16.2 8.4,15 U$1.10
  Bottom 0.254: v82,66.3 73.9,66.3 73.1,67.1 69.7,67.1 60.3,57.7 60.3,39.9 59.4,39 36.3,39 35.5,38.2 30.8,38.2 27.4,34.8 v23.9,34.8
EN4  (via drill 0.51)
  Top 0.254: v148.7,48.9 149.5,48.1 150.5,48.1 IC3.2 | v35.2,39.2 v68.5,39.2
  Bottom 0.254: v148.7,48.9 142.9,48.9 133.2,39.2 v68.5,39.2 | v35.2,39.2 30.1,44.3 9.5,44.3 8.4,45.4 U$1.34
EN5  (via drill 0.51)
  Top 0.254: v137.6,58.3 140.4,58.3 IC3.11
  Bottom 0.254: v137.6,58.3 96.3,58.3 85.4,69.2 44.5,69.2 37.7,76 9.9,76 7.1,73.2 7.1,49.2 8.3,48 U$1.36
GND  (via drill 0.51, 0.6)
  Top 0.254: U$1.48 57.15,3.81 58.42,3.81 U$1.47 | U$1.2 8.89,3.81 10.16,3.81 U$1.1 | 57.15,57.15 58.42,57.15 U$1.89 59.2,58.1 61.2,56.1 83.8,56.1 IC2.19 | 57.15,57.15 U$1.90 | 57.15,59.69 58.42,59.69 U$1.91 | 57.15,59.69 U$1.92 57.15,59.69 | 57.15,59.69 57.15,57.15 | 57.15,57.15 U$1.90 | v157.48,58.42 151.13,58.42 IC3.10 | 86.36,56.05 86.36,55.88 86.36,56.05 | 86.36,56.05 86.36,63.5 88.9,66.04 93.98,66.04 IC2.10 | 31.9,55.28 31.9,55.1 C3.2 31.9,52.4 31.9,51.1 26,45.2 26,18 29.8,14.2 31.6,14.2 JP1.2 | IC1.10 36,66.7 35.3,66.7 33.3,64.7 33.3,55.4 33.3,55.28 | 90.5,54.5 90.5,54.3 90.5,51.3 C2.2 90.5,51.1 90.5,40.2 104.9,25.8 C11.- | IC1.1 36.2,55.3 54.3,55.3 56.7,57.7 U$1.90
  Top 0.406: U$4.P$20 U$4.P$19 U$4.P$18 | U$5.P$28 U$5.P$27 U$5.P$26 | U$5.P$20 U$5.P$19 U$5.P$18 | U$6.P$28 U$6.P$27 U$6.P$26 | U$6.P$20 U$6.P$19 U$6.P$18 | U$7.P$20 U$7.P$19 U$7.P$18 | Q1.2 168.68,26.9 168.78,27 | IC3.1 150.5,46.76 150.5,45 147.4,45 C1.2 | IC3.1 143.72,46.78 142.5,48 140.53,48 IC3.19 | IC3.1 150.53,44.97 159,36.5 166.48,36.5 U$11.2 | IC1.1 33.3,55.28 31.9,55.28 28.71,55.28 27.5,56.5 25.03,56.5 IC1.19 | IC2.19 86.36,56.05 87.94,56.05 89.5,54.5 90.5,54.5 93.74,54.5 IC2.1
  Top 0.61: U$2.P$28 10,106 11,107 | 11,107 U$2.P$27 | U$2.P$26 12,106 11,107 | U$4.P$28 70,106 71,107 | 71,107 U$4.P$27 | U$4.P$26 72,106 71,107 | U$7.P$28 160,106 161,107 | 161,107 U$7.P$27 | U$7.P$26 162,106 161,107 | U$3.P$28 U$3.P$27 U$3.P$26 | U$3.P$20 U$3.P$19 U$3.P$18 | U$2.P$20 U$2.P$19 U$2.P$18 | IC4.6 149.04,13.04 150.5,14.5 | 150.5,14.5 156.28,14.5 C10.- | IC4.6 IC4.5 IC4.4 | IC4.6 138.96,13.04 139,13 | 150.5,14.5 145.2,19.8 D1.A 110.7,19.8 C11.-
  Top 1.016: C6.- 8,110 11,107
  Top 1.422: C7.2 10.26,116.72 C6.- | POWER_IN.P$2 136,118 136.5,117.5 140.9,117.5 C9.2 C8.2 151.86,117.6 C5.- | v161,108 161,107 | v71,108 71,107 | U$4.P$19 v79,108 | U$5.P$27 v101,108 | U$5.P$19 v109,108 | U$6.P$27 v131,108 | U$6.P$19 v139,108 | U$7.P$19 169,112.46 C4.- | U$2.P$19 v19,108 | U$3.P$27 v41,108 | U$3.P$19 v49,108 | U$11.2 168.78,33.22 | 168.78,33.22 v171.5,33.5 | 168.78,33.22 168.78,27 168.78,20.28 163.5,15 156.78,15 C10.-
  Bottom 0.254: v157.48,58.42 163.83,58.42 164,58.42 | U$1.1 10.9,4.8 20.2,14.1 31.6,14.1 JP1.2 31.8,14.1 41,4.9 56.5,4.9 U$1.48
  Bottom 1.422: v161,108 155,108 | 155,108 v139,108 | v139,108 138,108 | 138,108 132,108 | 132,108 v131,108 | v131,108 110.5,108 | 110.5,108 v109,108 | v109,108 103,108 | 103,108 v101,108 | v101,108 84,108 | 84,108 v79,108 | v79,108 v71,108 v49,108 v41,108 18.5,108 | v79,108 84,108 | v101,108 103,108 | v109,108 110.5,108 | v131,108 132,108 | v139,108 138,108 | 155,108 C5.- 155.5,114.46 | C4.- 155.5,114.46 | v19,108 18.5,108 | 18.5,108 14.46,108 C6.- | v171.5,33.5 171.5,44 164,51.5 164,58.42 164,65.5 154,75.5 154,102 155,103 155,113.96 155.5,114.46
IN0A  (via drill 0.51)
  Top 0.254: v34.2,59.1 36,59.1 IC1.4 | v14.8,59.1 12.5,59.1 10.9,60.7 U$1.45
  Bottom 0.254: v14.8,59.1 v34.2,59.1
IN0B  (via drill 0.51)
  Top 0.254: v34.2,64.2 36,64.2 IC1.8 | v18.9,66.5 v21.5,66.5
  Bottom 0.254: v34.2,64.2 23.8,64.2 v21.5,66.5 | v18.9,66.5 14.2,66.5 8.4,60.7 U$1.46
IN1A  (via drill 0.51)
  Top 0.254: v21.3,64.1 25.9,64.1 IC1.13
  Bottom 0.254: v21.3,64.1 16.8,64.1 10.9,58.2 U$1.43
IN1B  (via drill 0.51)
  Top 0.254: v24.1,60.3 25.3,59.1 25.9,59.1 IC1.17
  Bottom 0.254: v24.1,60.3 14.7,60.3 11.4,57 9.5,57 8.4,58.1 U$1.44
IN2A  (via drill 0.51)
  Top 0.254: v87.8,58.5 94,58.5 IC2.4 | v81.2,51.9 35,51.9 v33.5,53.4
  Bottom 0.254: v81.2,51.9 v87.8,58.5 | v33.5,53.4 30,53.4 26.1,49.5 17,49.5 10.9,55.6 U$1.41
IN2B  (via drill 0.51)
  Top 0.254: v91.6,65.1 93,63.7 94,63.7 IC2.8 | v6.8,76.8 6.8,57.2 8.3,55.7 U$1.42
  Bottom 0.254: v91.6,65.1 91.1,65.1 78.4,77.8 7.8,77.8 v6.8,76.8
IN3A  (via drill 0.51)
  Top 0.254: v76,67.2 79.5,63.7 83.9,63.7 IC2.13 | v34.8,53.4 v48.3,53.4
  Bottom 0.254: v76,67.2 73.8,67.2 73.3,67.7 61.9,67.7 48.3,54.1 v48.3,53.4 | v34.8,53.4 30.3,48.9 15,48.9 10.9,53 U$1.39
IN3B  (via drill 0.51)
  Top 0.254: v41.3,56.2 47,61.9 59.6,61.9 62.9,58.6 83.9,58.6 IC2.17
  Bottom 0.254: v41.3,56.2 41.3,55.9 32.4,47 16.1,47 11.2,51.9 9.5,51.9 8.4,53 U$1.40
IN4A  (via drill 0.51)
  Top 0.254: v147.3,50.5 150.5,50.5 IC3.4 | v73,43.7 60,43.7 59.6,44.1 33.2,44.1 v29.5,40.4
  Bottom 0.254: v147.3,50.5 140.6,50.5 133.8,43.7 v73,43.7 | v29.5,40.4 10.9,40.4 U$1.29
IN4B  (via drill 0.51)
  Top 0.254: v142.5,53.2 144.9,55.6 150.5,55.6 IC3.8 | v85.3,46.6 34.4,46.6 v26.9,39.1
  Bottom 0.254: v142.5,53.2 135.9,46.6 v85.3,46.6 | v26.9,39.1 9.6,39.1 8.4,40.3 U$1.30
IN5A  (via drill 0.51)
  Top 0.254: v134.3,55.6 140.4,55.6 IC3.13 | v75.2,44.6 72.2,41.6 32,41.6 v28.3,37.9
  Bottom 0.254: v134.3,55.6 93,55.6 82,44.6 v75.2,44.6 | v28.3,37.9 10.9,37.9 U$1.27
IN5B  (via drill 0.51)
  Top 0.254: v92.1,50.5 140.4,50.5 IC3.17 | v86.8,48.1 60.7,48.1 59.6,49.2 32.7,49.2 v26.9,43.4
  Bottom 0.254: v92.1,50.5 89.2,50.5 v86.8,48.1 | v26.9,43.4 13,43.4 11.2,41.6 7.9,41.6 7.1,40.8 7.1,39.1 8.3,37.9 U$1.28
N$1
  Top 0.406: U$2.P$6 13,80.86 arc-90 12.63,80.5 arc90 12,79.86 R1.2
N$2
  Top 0.406: R5.1 18,75.86 arc90 17.36,76.5 12.63,76.5 arc90 12,75.86 R1.1 12,74.14 arc90 12.63,73.5 arc-90 13,73.14 R7.2 R6.2
N$3
  Top 0.254: R7.1 13,69 14.1,69 25.2,57.9 25.9,57.9 IC1.18
N$4  (via drill 0.51)
  Top 0.254: v10.3,75.1 10.3,75.2 9,76.5 R2.1 | v24.1,61.6 25.3,60.4 25.9,60.4 IC1.16
  Bottom 0.254: v10.3,75.1 11.6,75.1 24.1,62.6 v24.1,61.6
N$5
  Top 0.406: IC1.14 21.09,62.91 15,69 R3.1
N$6
  Top 0.406: IC1.12 23.55,65.44 22.5,66.5 22.5,70.5 21,72 R4.1
N$7
  Top 0.61: IC4.12 114.5,9.23 | 114.5,9.23 103.33,9.23 L1.P$1 | D1.C 114.5,9.23
N$8
  Top 1.676: BRAKE.P$1 168,49.5 166.5,48 U$11.3
N$9
  Top 0.406: U$2.P$5 12,82.14 arc-90 11.37,81.5 9.63,81.5 arc90 9,80.86 R2.2
N$10
  Top 0.406: U$2.P$8 15,78.5 R3.2
N$11
  Top 0.406: U$2.P$11 18,82.14 arc90 18.64,81.5 20.36,81.5 arc-90 21,80.86 R4.2
N$12
  Top 0.406: U$2.P$10 17,80.64 arc90 17.64,80 arc-90 18,79.64 R5.2
N$13
  Top 0.406: U$3.P$6 43,80.36 arc-90 42.63,80 arc90 42,79.36 R8.2
N$14
  Top 0.406: R8.1 42,76.5 48,76.5 R12.1 48,73.86 arc-90 47.63,73.5 arc90 47,72.86 R14.2 R13.2
N$15  (via drill 0.51)
  Top 0.254: v43.9,68.5 47,68.5 R14.1 | v37.9,66.7 36.7,65.5 36.1,65.5 IC1.9
  Bottom 0.254: v43.9,68.5 39.7,68.5 v37.9,66.7
N$16
  Top 0.406: IC1.7 37.91,62.91 39,64 R9.1
N$17
  Top 0.406: IC1.5 37.87,60.37 42,64.5 42,70 45,73 R10.1
N$18
  Top 0.254: R11.1 51,76.5 51,72.7 51.3,72.4 51.3,70.4 50.7,69.8 43.9,69.8 42.6,68.5 42.6,63.7 36.8,57.9 36.1,57.9 IC1.3
N$19
  Top 0.406: U$11.1 164,33.98 Q1.3 161.9,29.1 161,30 R43.2
N$20
  Top 0.406: U$7.P$11 168,82.14 arc90 168.63,81.5 170.37,81.5 arc-90 171,80.86 R39.2
N$21
  Top 0.406: U$7.P$8 R38.2
N$22
  Top 0.406: U$7.P$5 162,82.14 arc-90 161.37,81.5 159.63,81.5 arc90 159,80.86 R37.2
N$23
  Top 0.406: U$7.P$10 167,80.64 arc90 167.63,80 arc-90 168,79.64 R40.2
N$24
  Top 0.406: U$4.P$6 73,80.86 arc-90 72.64,80.5 arc90 72,79.86 R15.2
N$25
  Top 0.406: R19.1 78,76.5 72,76.5 R15.1 72,73.86 arc90 72.36,73.5 arc-90 73,72.86 R21.2 R20.2
N$26  (via drill 0.51)
  Top 0.254: v73,65.9 73,69 R21.1 | v81.2,57.7 83.6,57.7 83.9,57.4 IC2.18
  Bottom 0.254: v81.2,57.7 v73,65.9
N$27
  Top 0.406: IC2.16 69,60 67.5,61.5 67.5,75.08 R16.1
N$28
  Top 0.406: IC2.14 76.5,62.5 75,63.5 R17.1
N$29
  Top 0.406: IC2.12 81,65 R18.1
N$30
  Top 0.406: U$3.P$10 47,80.64 arc90 47.63,80 arc-90 48,79.64 R12.2
N$31
  Top 0.406: U$3.P$11 48,82.14 arc90 48.63,81.5 50.37,81.5 arc-90 51,80.86 R11.2
N$32
  Top 0.406: U$4.P$5 72,82.14 arc-90 71.36,81.5 69.64,81.5 arc90 69,80.86 R16.2
N$33
  Top 0.406: U$4.P$8 R17.2
N$34
  Top 0.406: U$4.P$11 78,81.64 arc90 78.64,81 80.36,81 arc-90 81,80.36 R18.2
N$35
  Top 0.406: U$4.P$10 77,80.64 arc90 77.64,80 arc-90 78,79.64 R19.2
N$36
  Top 0.406: U$5.P$6 103,80.86 arc-90 102.64,80.5 arc90 102,79.86 R22.2
N$37
  Top 0.406: R22.1 102,76.5 108,76.5 R26.1 108,74.14 arc-90 107.36,73.5 arc90 107,73.14 R28.2 R27.2
N$38  (via drill 0.51)
  Top 0.254: v107,67.5 107,69 R28.1 | v97.2,67.5 94.7,65 94.1,65 IC2.9
  Bottom 0.254: v97.2,67.5 v107,67.5
N$39
  Top 0.406: IC2.7 98,62.5 99,63 R23.1
N$40
  Top 0.406: IC2.5 102,60 105,62.5 R24.1
N$41
  Top 0.406: IC2.3 107.5,57.5 113,63 113,74.58 R25.1
N$42
  Top 0.406: U$3.P$8 R10.2
N$43
  Top 0.406: U$3.P$5 42,82.14 arc-90 41.37,81.5 39.63,81.5 arc90 39,80.86 R9.2
N$44
  Top 0.406: U$6.P$6 133,80.36 arc-90 132.63,80 arc90 132,79.36 R29.2
N$45
  Top 0.406: R33.1 138,75.86 arc90 137.37,76.5 132.63,76.5 arc90 132,75.86 R29.1 132,74.14 arc90 132.63,73.5 arc-90 133,73.14 R35.2 R34.2
N$46  (via drill 0.51)
  Top 0.254: v131.9,54.7 131.9,63.3 133,64.4 133,69 R35.1 | v137.2,49.4 140.4,49.4 IC3.18
  Bottom 0.254: v137.2,49.4 v131.9,54.7
N$47
  Top 0.406: IC3.16 133.13,51.87 126.5,58.5 126.5,72 129,74.5 R30.1
N$48
  Top 0.406: IC3.14 134.09,54.41 132.5,56 132.5,63 135,65.5 R31.1
N$49
  Top 0.406: IC3.12 137.56,56.95 136.5,58 136.5,61.5 141,66 R32.1
N$50
  Top 0.406: U$5.P$10 107,80.5 arc90 107.5,80 arc-90 108,79.5 R26.2
N$51
  Top 0.406: U$5.P$11 108,82.14 arc90 108.64,81.5 110.36,81.5 arc-90 111,80.86 R25.2
N$52
  Top 0.406: U$6.P$5 132,82.14 arc-90 131.37,81.5 129.63,81.5 arc90 129,80.86 R30.2
N$53
  Top 0.406: U$6.P$8 R31.2
N$54
  Top 0.406: U$6.P$11 138,82.14 arc90 138.63,81.5 140.37,81.5 arc-90 141,80.86 R32.2
N$55
  Top 0.406: U$6.P$10 137,80.64 arc90 137.63,80 arc-90 138,79.64 R33.2
N$56
  Top 0.406: U$7.P$6 163,80.36 arc-90 162.63,80 arc90 162,79.36 R36.2
N$57
  Top 0.406: R36.1 162,76.5 168,76.5 R40.1 168,74.14 arc-90 167.37,73.5 arc90 167,73.14 R42.2 R41.2
N$58  (via drill 0.51)
  Top 0.254: v156.3,51 167,61.7 167,69 R42.1 | v152.4,55.7 151.2,56.9 150.6,56.9 IC3.9
  Bottom 0.254: v156.3,51 156.3,51.8 v152.4,55.7
N$59
  Top 0.406: IC3.7 156.91,54.41 159,56.5 R37.1
N$60
  Top 0.406: IC3.5 155.87,51.87 165,61 R38.1
N$61
  Top 0.406: IC3.3 156.82,49.33 173.5,66 173.5,72 171,74.5 R39.1
N$62
  Top 0.406: U$5.P$8 R24.2
N$63
  Top 0.406: U$5.P$5 102,82.14 arc-90 101.36,81.5 99.64,81.5 arc90 99,80.86 R23.2
OUT0A
  Top 0.61: 13,108.5 U$2.P$25
  Top 1.016: U$8.P$1 42.06,118.56 40,116.5 28,116.5 23.5,112 16.5,112 13,108.5
  pour Top (isolate 1.27, no thermals): 12,95 1,95 1,106 6,106 6,99 12,99
OUT0B
  Top 0.61: 26.5,108.5 26.5,98.5 25.5,97.5 19.61,97.5 U$2.T$2
  Top 1.016: U$8.P$2 47.14,115.64 46,114.5 32.5,114.5 26.5,108.5
  pour Top (no thermals): 17,95 29,95 29,106 24,106 24,105 24,99 17,99
OUT1A
  Top 0.61: 38,110.5 U$3.P$30
  Top 1.016: U$8.P$3 52.22,116.22 49,113 40.5,113 38,110.5
  pour Top (no thermals): 43,95 31,95 31,106 36,106 36,99 43,99
OUT1B
  Top 0.61: 57.3,98.8 55.5,97 49.22,97 U$3.T$2
  Top 1.27: U$8.P$4 57.3,98.8
  pour Top (no thermals): 47,99 54,99 54,106 59,106 59,95 47,95
OUT2A
  Top 0.61: 62.38,99.12 64.5,97 70.78,97 U$4.T$1
  Top 1.27: U$8.P$5 62.38,99.12
  pour Top (no thermals): 73,99 66,99 66,106 61,106 61,95 73,95
OUT2B
  Top 0.61: 82,108.5 U$4.P$16
  Top 1.016: U$8.P$6 67.46,110.54 68,110 80.5,110 82,108.5
  pour Top (no thermals): 77,99 84,99 84,106 89,106 89,95 77,95
OUT3A
  Top 0.61: 93.5,98.5 94,98 99.89,98 U$5.T$1
  Top 1.016: U$8.P$7 72.54,115.96 77,111.5 89.5,111.5 93.5,107.5 93.5,98.5
  pour Top (no thermals): 103,99 96,99 96,106 91,106 91,95 103,95
OUT3B
  Top 0.61: 112,109 U$5.P$16
  Top 1.016: U$8.P$8 77.62,115.88 80.5,113 108,113 112,109
  pour Top (no thermals): 107,99 114,99 114,106 119,106 119,95 107,95
OUT4A
  Top 0.61: 124,105 124,97.5 124.5,97 130.78,97 U$6.T$1
  Top 1.016: U$8.P$9 82.7,115.8 84,114.5 114.5,114.5 124,105
  pour Top (no thermals): 133,99 126,99 126,106 121,106 121,95 133,95
OUT4B
  Top 0.61: 142,109 U$6.P$16
  Top 1.016: U$8.P$10 87.78,117.22 89,116 116,116 122,110 141,110 142,109
  pour Top (no thermals): 137,99 144,99 144,106 149,106 149,95 137,95
OUT5A
  Top 0.61: U$8.P$11 92.86,119.64 | 154,104 154,97 160.78,97 U$7.T$1
  Top 1.016: 92.86,119.64 95,117.5 117,117.5 123,111.5 141.5,111.5 144.5,108.5 149.24,108.5 arc-45 149.69,108.31 154,104
  pour Top (no thermals): 163,99 156,99 156,106 151,106 151,95 163,95
OUT5B
  Top 0.61: U$8.P$12 97.94,120.56 | 167,107.74 U$7.P$21
  Top 1.016: 97.94,120.56 99.5,119 118.5,119 124.5,113 149,113 151,111 163.74,111 arc-45 164.19,110.81 166.81,108.19 arc-45 167,107.74
  pour Top (no thermals): 167,99 174,99 174,106 179,106 179,95 167,95
PWM0  (via drill 0.51)
  Top 0.254: v37.9,61.8 37.8,61.7 36.1,61.7 IC1.6
  Bottom 0.254: v37.9,61.8 38.6,61.8 56.3,44.1 58,44.1 59.1,43 U$1.77
PWM1  (via drill 0.51)
  Top 0.254: v32.4,61.6 26,61.6 IC1.15
  Bottom 0.254: v32.4,61.6 36.8,61.6 39.5,58.9 39.9,58.9 55.4,43.4 55.4,42.4 56.2,41.6 57.9,41.6 59.1,40.4 U$1.75
PWM2  (via drill 0.51)
  Top 0.254: v92.2,61.1 94,61.1 IC2.6 | v76.6,45.5 76.6,38.4 59.4,21.2 57.7,21.2 56.6,20.1 U$1.60
  Bottom 0.254: v76.6,45.5 v92.2,61.1
PWM3  (via drill 0.51)
  Top 0.254: v82.1,61.1 83.9,61.1 IC2.15
  Bottom 0.254: v82.1,61.1 82.1,55.5 82.4,55.2 82.4,54.4 59.4,31.4 58.6,31.4 57.8,30.6 57.8,23.8 U$1.62
PWM4  (via drill 0.51)
  Top 0.254: v143.9,48 143.9,48.4 148.6,53.1 150.5,53.1 IC3.6 | v47.7,21.4 35.6,21.4 34.7,20.5 v26.9,20.5
  Bottom 0.254: v143.9,48 142.8,48 116.2,21.4 v47.7,21.4 | v26.9,20.5 11.3,20.5 10.9,20.1 U$1.13
PWM5  (via drill 0.51)
  Top 0.254: v142.3,49.6 142.3,52 141.2,53.1 140.5,53.1 IC3.15 | v70.7,40.1 67.3,36.7 36.2,36.7 34.7,38.2 31.2,38.2 28.3,35.3 v28.3,28.9
  Bottom 0.254: v142.3,49.6 140.5,49.6 131,40.1 v70.7,40.1 | v28.3,28.9 28.3,28.1 27.3,27.1 11.4,27.1 10.9,27.6 U$1.19
Q0A
  Bottom 0.254: U$1.3 10.9,7.4 12.7,7.4 20.4,15.1 31,15.1 31.4,15.5 33.1,15.5 34.2,16.6 JP1.3
Q0B  (via drill 0.51)
  Top 0.254: v28.7,16.6 31.6,16.6 JP1.4
  Bottom 0.254: v28.7,16.6 20.2,16.6 14.9,11.3 10.6,11.3 9.7,10.4 9.7,9.6 8.4,8.3 8.4,7.4 U$1.4
Q0I
  Bottom 0.254: U$1.5 10.9,9.9 14.4,9.9 20.2,15.7 29.1,15.7 31.4,18 33,18 34.2,19.2 JP1.5
Q1A
  Bottom 0.254: U$1.6 8.4,9.9 8.4,10.9 9.7,12.2 9.7,12.9 10.6,13.8 16.6,13.8 20.5,17.7 30.1,17.7 31.6,19.2 JP1.6
Q1B
  Bottom 0.254: U$1.11 10.9,17.6 19.6,17.6 20.3,18.3 29.1,18.3 31.3,20.5 33,20.5 34.2,21.7 JP1.7
Q1I
  Bottom 0.254: U$1.12 8.4,17.6 9.3,17.6 10.6,18.9 28.8,18.9 31.6,21.7 JP1.8
Q2A
  Bottom 0.254: U$1.15 10.9,22.6 30.9,22.6 31.4,23.1 33.1,23.1 34.2,24.2 JP1.9
Q2B
  Bottom 0.254: U$1.16 8.4,22.6 9.2,22.6 10.6,24 31.4,24 31.6,24.2 JP1.10
Q2I
  Bottom 0.254: U$1.20 8.4,27.6 9.3,27.6 10.6,26.3 30.5,26.3 31.2,25.6 33,25.6 34.2,26.8 JP1.11
Q3A
  Bottom 0.254: U$1.21 10.9,30.2 28.3,30.2 31.6,26.9 JP1.12
Q3B  (via drill 0.51)
  Top 0.254: JP1.13 34.29,29.21 33.02,27.94 32.9,27.9 32.3,27.9 32.2,28 v26.9,28
  Bottom 0.254: v26.9,28 12.2,28 11.2,29 9.6,29 8.4,30.2 U$1.22
Q3I
  Bottom 0.254: U$1.23 10.9,32.7 28.3,32.7 31.6,29.4 JP1.14
Q4A
  Bottom 0.254: U$1.24 8.4,32.7 9.3,32.7 10.6,31.4 28,31.4 31.2,28.2 32.2,28.2 33,29 33,30.7 34.2,31.9 JP1.15
Q4B
  Bottom 0.254: U$1.25 10.9,35.3 21.3,35.3 23.3,33.3 30.2,33.3 31.6,31.9 JP1.16
Q4I
  Bottom 0.254: U$1.26 8.4,35.3 9.2,35.3 10.4,36.5 20.9,36.5 23.5,33.9 29.5,33.9 31.2,35.6 33.1,35.6 34.2,34.5 JP1.17
Q5A
  Bottom 0.254: U$1.58 56.5,17.6 50.2,17.6 34.6,33.2 32.9,33.2 31.7,34.4 JP1.18
Q5B
  Top 0.254: U$1.61 59.1,22.6 58.2,22.6 56.8,24 47.2,24 34.3,36.9 JP1.19
Q5I
  Bottom 0.254: U$1.69 59.1,32.8 58.2,32.8 56.9,34.1 36.2,34.1 34.5,35.8 33.7,35.8 32.6,36.9 31.7,36.9 JP1.20
VCC  (via drill 0.51)
  Top 0.254: U$1.52 57.15,8.89 58.42,8.89 U$1.51 59.2,9.9 94.8,9.9 L1.P$2 | R27.1 110,69.1 110,69.6 111.3,70.9 111.3,74 109.7,75.6 109.7,77.6 109.9,77.8 130.1,77.8 130.3,77.6 130.3,74.5 128.7,72.9 128.7,70.4 130,69.1 R34.1 130.1,69 v132.1,67 | v153.7,50.3 153.9,50.1 156.7,50.1 170,63.4 170,69 R41.1 | v146,42.6 144.8,42.6 144.6,42.6 | R6.1 10,69 10.8,69 25.8,54 25.97,54.03 | C11.+ 95.9,25.8 87.7,34 87.7,51.1 C2.1 87.6,51.3 87.4,51.3 84,54.7 IC2.20 83.9,54.8 v81.5,54.8 | v70.1,66.2 70.1,69 R20.1 70,69.1 68.7,70.4 68.7,72.9 70.3,74.5 70.3,77.6 70.1,77.8 67.9,77.8 58.7,68.6 50,68.6 R13.1 49.9,68.5 v39.4,58 | v30.9,54.3 29.2,52.6 C3.1 | v122.2,18.7 122.2,18.3 122.2,18
  Top 0.406: R43.1 149.5,30 144.6,34.9 144.6,42.6 C1.1 140.47,44 IC3.20 | IC1.20 25.97,54.03 27,52.5 C3.1
  Top 0.61: IC4.3 132.27,9.23 128,13.5 128,14.5 125,17.5 124.5,18 122.2,18 103.5,18 C11.+ 95.08,24.58 L1.P$2
  Bottom 0.254: 151.25,47.85 v146,42.6 146,42.5 v122.2,18.7 | 151.25,47.85 v153.7,50.3 | v132.1,67 151.2,47.9 151.25,47.85 | v81.5,54.8 v70.1,66.2 | v30.9,54.3 35.7,54.3 v39.4,58

### Text on the board
tPlace: A | B | A | B | A | B | A | B | A | B | A | B | GND | +24V | [ | [ | [ | [ | [ | [ | 0 | 1 | 2 | 3 | 4 | 5 | BRAKE | 19 | 20 | SERVITRON SIX | Q5I | Q5B | Q5A | Q4I | Q4A | Q4B | Q3I | Q3B | Q3A | Q2I | Q2B | Q2A | 6-AXIS DC SERVO DRIVER BOARD / FEB2013ROTM VERSION ZERO / Licensed under CERN OHL v1.1.1 | Q1I | Q1B | Q1A | Q0I | Q0B | Q0A | GND | 3V3 | 2 | 1 | RETURN WITHOUT GOSUB : NEXT WITHOUT FOR